# Altium schematic sheet Heater Control.SchDoc
size A4; DrawnBy: Lorna Lan; DocumentNumber: 15; Revision: v4.3; SheetNumber: 15; SheetTotal: 20
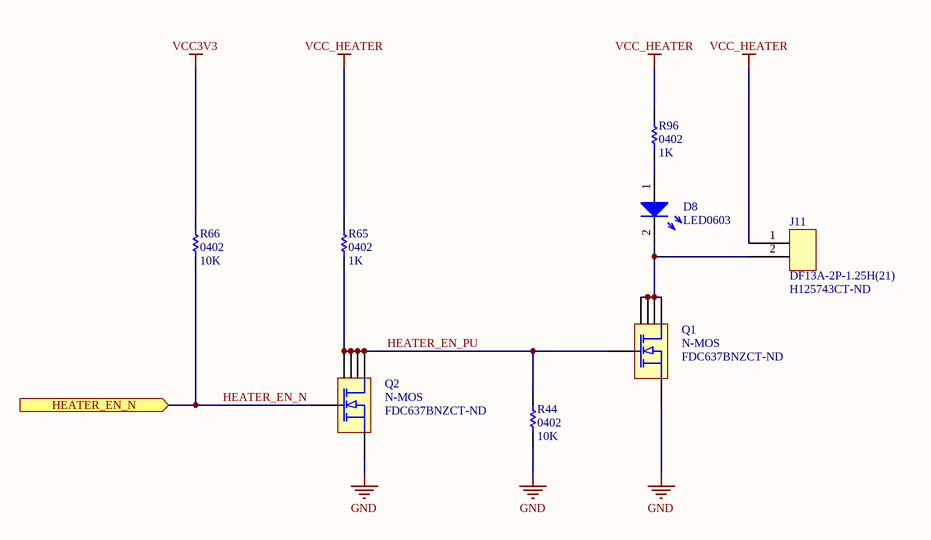
[diagram p0: Heater Control.SchDoc]

## Parts
D8  LED0603  [LED0603]
J11  DF13A-2P-1.25H(21)  Supplier Part Number 1: H125743CT-ND  [DF13A-2P-1.25H(21)]
Q1  N-MOS  [SOT95P280X145-6N]
Q2  N-MOS  [SOT95P280X145-6N]
R44  0402  value 10K  [RES0402R]
R65  0402  value 1K  [RES0402R]
R66  0402  value 10K  [RES0402R]
R96  0402  value 1K  [RES0402R]

## Ports
HEATER_EN_N (in)

## Nets
GND: Q1.4(S) Q2.4(S) R44.1
VCC3V3: R66.2
VCC_HEATER: J11.1 R65.2 R96.2
HEATER_EN_N: Q2.3(G) R66.1 ; port HEATER_EN_N
HEATER_EN_PU: Q1.3(G) Q2.1(D) Q2.2(D) Q2.5(D) Q2.6(D) R44.2 R65.1
NetD8_1: D8.1 R96.1
NetD8_2: D8.2 J11.2 Q1.1(D) Q1.2(D) Q1.5(D) Q1.6(D)

## Library data of the parts
D8 = LED0603: Generic 0603 LED. Use ChipLED from Osram for generic ones.
J11 = DF13A-2P-1.25H(21): 2 pos DF13 right angle surface mount connector; Supplier 1: Digi-Key
Q1 Q2 = FDC637BNZCT-ND: 20V 6.2A, N-MOS, low gate on voltage; Supplier 1: Digi-Key; Supplier Part Number 1: FDC637BNZCT-ND
R44 R66 = RES0402: 0402 resistor; Manufacturer: Panasonic; Manufacturer Part Number: ERJ-2RKF1002X; Resistance: 10kR; Power Rating: 100mW; Tolerance: 1%; Voltage Rating: 50V; Temperature Coefficient: 100ppm/°C; Supplier 1: Digi-Key; Supplier Part Number 1: P10.0KLCT-ND; Stock 1: 14350001; Pricing 1: 1=0.1, 10=0.045, 100=0.0183, 1000=0.00823, 2500=0.00715, 5000=0.0059 (USD); Mount: Surface Mount; Case/Package: 0402; Number of Pins: 2; Case Code (Metric): 1005; Case Code (Imperial): 0402; Contact Plating: Tin; Min Operating Temperature: -55°C; Max Operating Temperature: 155°C; Packaging: Tape and Reel; Package Quantity: 1; Composition: Thick Film; Number of Terminations: 2; Termination: SMD/SMT; Military Standard: Not; Max Power Dissipation: 100mW; Voltage Rating (DC): 50V; Features: Automotive AEC-Q200; Length: 1mm; Height: 0.35mm; Width: 0.02inch; Depth: 0.5mm; Radiation Hardening: No; REACH SVHC: No SVHC; Lead Free: Lead Free; ComponentLink1URL: http://industrial.panasonic.com/www-data/pdf/AOA0000/AOA0000CE2.pdf?src-supplier=Future+Electronics; ComponentLink1Description: http://industrial.panasonic.com/www-data/pdf/AOA0000/AOA0000CE2.pdf?src-supplier=Future+Electronics; ComponentLink2URL: http://industrial.panasonic.com/www-data/pdf/AOA0000/AOA0000CE2.pdf?src-supplier=Avnet+Europe; ComponentLink2Description: http://industrial.panasonic.com/www-data/pdf/AOA0000/AOA0000CE2.pdf?src-supplier=Avnet+Europe; ComponentLink3URL: https://industrial.panasonic.com/cdbs/www-data/pdf/RDA0000/DMA0000COL11.pdf?src-supplier=Mouser; ComponentLink3Description: https://industrial.panasonic.com/cdbs/www-data/pdf/RDA0000/DMA0000COL11.pdf?src-supplier=Mouser; ComponentLink4URL: http://www.farnell.com/datasheets/1678782.pdf?src-supplier=Element14; ComponentLink4Description: http://www.farnell.com/datasheets/1678782.pdf?src-supplier=Element14; ComponentLink5URL: http://www.farnell.com/datasheets/1911175.pdf?src-supplier=Farnell; ComponentLink5Description: http://www.farnell.com/datasheets/1911175.pdf?src-supplier=Farnell; ComponentLink6URL: http://www.jameco.com/Jameco/Products/ProdDS/1987020.pdf?src-supplier=Jameco; ComponentLink6Description: http://www.jameco.com/Jameco/Products/ProdDS/1987020.pdf?src-supplier=Jameco; ComponentLink7URL: http://industrial.panasonic.com/www-data/pdf/AOA0000/AOA0000CE2.pdf?src-supplier=Avnet; ComponentLink7Description: http://industrial.panasonic.com/www-data/pdf/AOA0000/AOA0000CE2.pdf?src-supplier=Avnet; ComponentLink8URL: http://www.alliedelec.com/m/d/623f45ff1957d936ff56d46fd1c28cac.pdf?src-supplier=Allied+Electronics; ComponentLink8Description: http://www.alliedelec.com/m/d/623f45ff1957d936ff56d46fd1c28cac.pdf?src-supplier=Allied+Electronics
R65 R96 = RES0402: 0402 resistor